# Altium schematic sheet zulu_a7_6.SchDoc
size 241 x 313 mm; Author: Christian Tambe; VERSION#: 1.0; Origin: Eagle; OriginPath: C:\Users\tambe\Documents\Electronics\Zulu_A7\Zulu_Altrium\zulu_a7.sch; OriginSheet: 7; OriginDescription: FPGA POWER
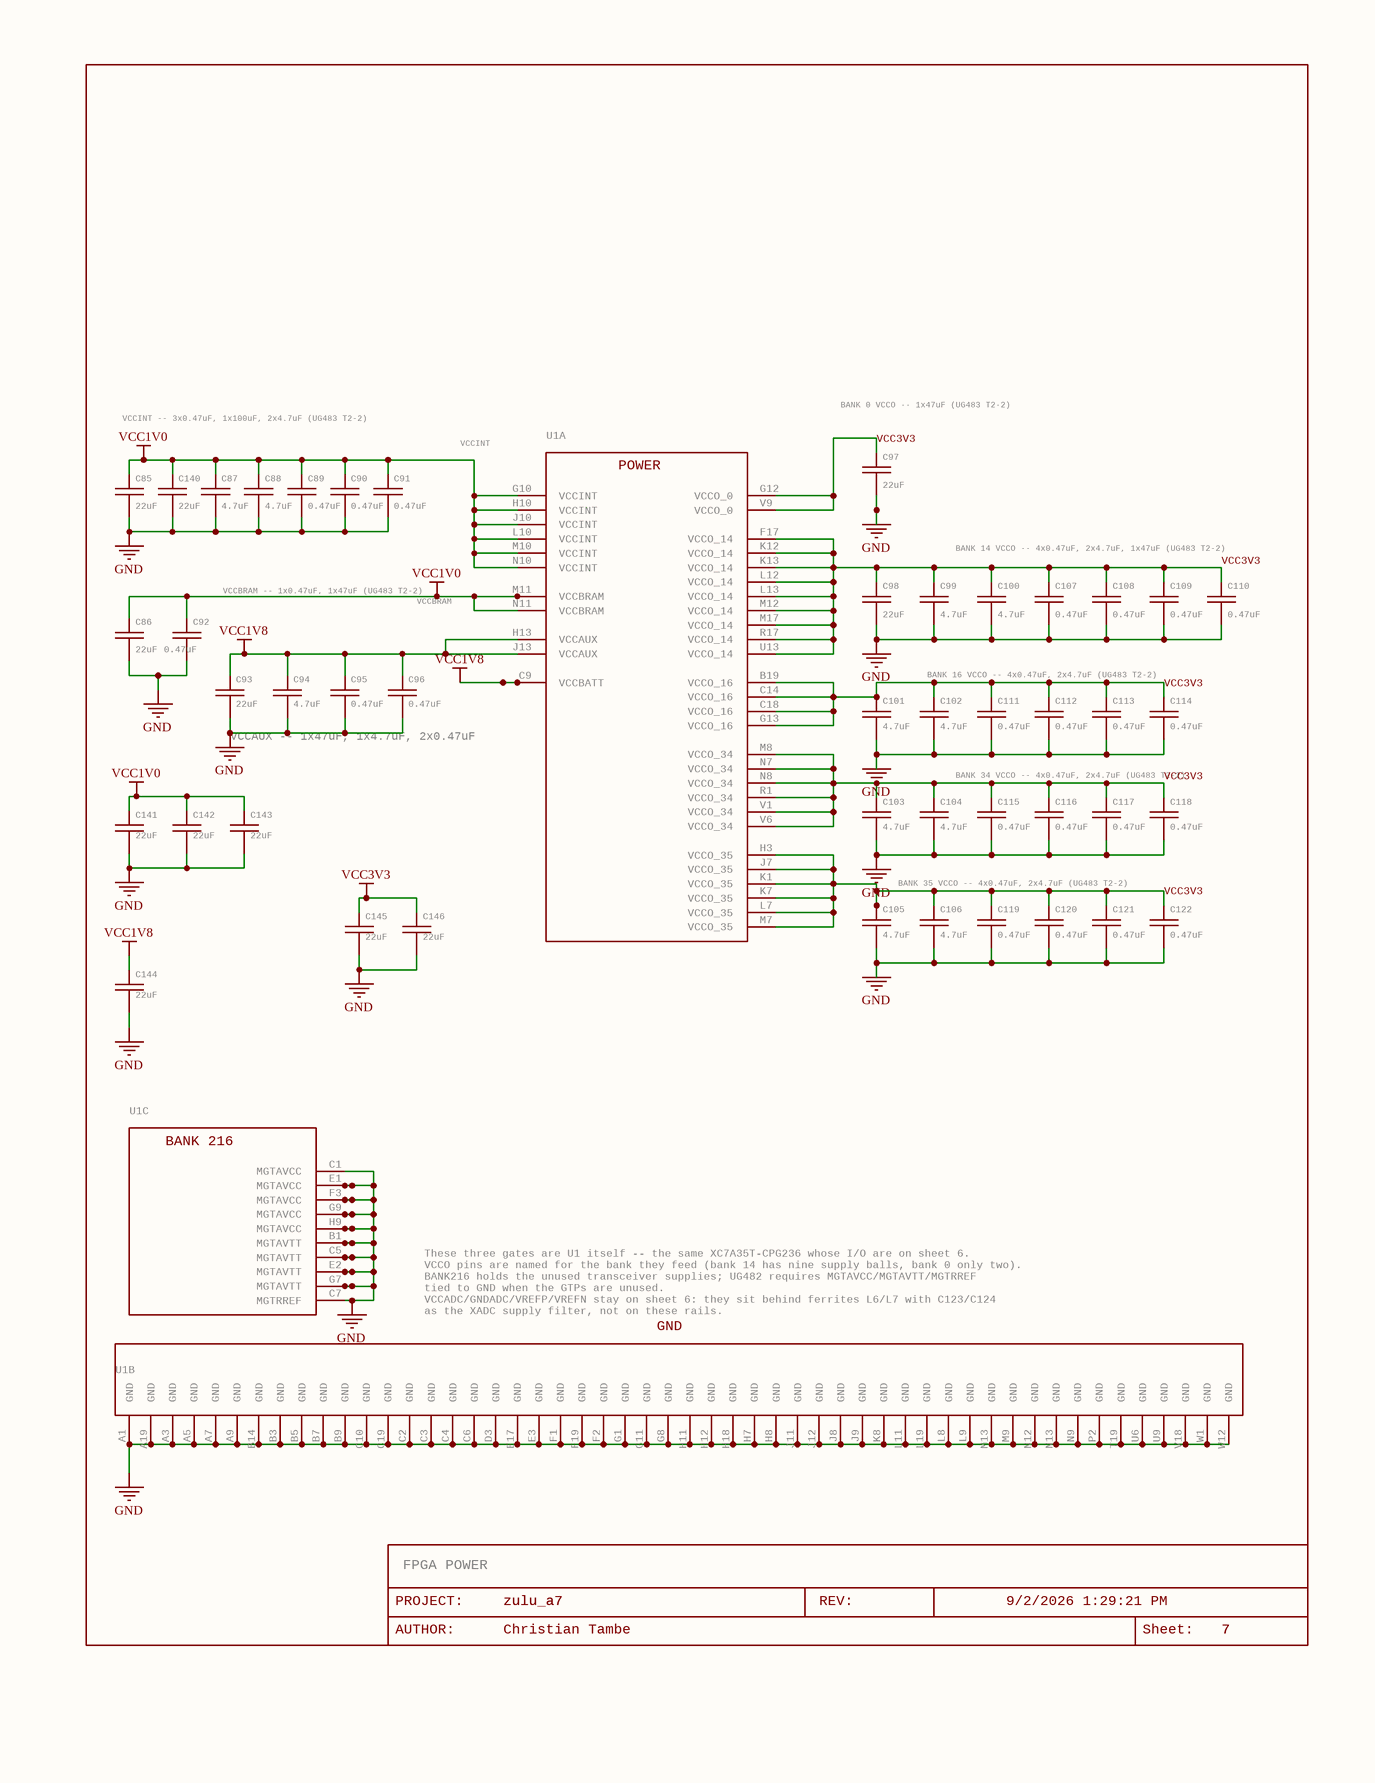
[diagram p0: zulu_a7_6.SchDoc]

## Parts
C85  22uF  [C0805]
C86  22uF  [C0805]
C87  4.7uF  [C0603]
C88  4.7uF  [C0603]
C89  0.47uF  [C0201]
C90  0.47uF  [C0201]
C91  0.47uF  [C0201]
C92  0.47uF  [C0201]
C93  22uF  [C0805]
C94  4.7uF  [C0603]
C95  0.47uF  [C0201]
C96  0.47uF  [C0201]
C97  22uF  [C0805]
C98  22uF  [C0805]
C99  4.7uF  [C0603]
C100  4.7uF  [C0603]
C101  4.7uF  [C0603]
C102  4.7uF  [C0603]
C103  4.7uF  [C0603]
C104  4.7uF  [C0603]
C105  4.7uF  [C0603]
C106  4.7uF  [C0603]
C107  0.47uF  [C0201]
C108  0.47uF  [C0201]
C109  0.47uF  [C0201]
C110  0.47uF  [C0201]
C111  0.47uF  [C0201]
C112  0.47uF  [C0201]
C113  0.47uF  [C0201]
C114  0.47uF  [C0201]
C115  0.47uF  [C0201]
C116  0.47uF  [C0201]
C117  0.47uF  [C0201]
C118  0.47uF  [C0201]
C119  0.47uF  [C0201]
C120  0.47uF  [C0201]
C121  0.47uF  [C0201]
C122  0.47uF  [C0201]
C140  22uF  [C0805]
C141  22uF  [C0805]
C142  22uF  [C0805]
C143  22uF  [C0805]
C144  22uF  [C0805]
C145  22uF  [C0805]
C146  22uF  [C0805]
FRAME6  LAST_DATE_TIME: 9/2/2026 1:29:21 PM  Sheet: Sheet:  SHEET: 7  REV: REV:  PROJECT: PROJECT:  DRAWING_NAME: zulu_a7  AUTHOR: Christian Tambe  (hidden comment: DOCFIELD)  (graphical)
U1  XC7A35T-1CPG236C  [XC7A35T-CPG236]  (value not drawn)  (parts A,B,C of 142)

## Nets
GND: C85.2 C86.2 C87.2 C88.2 C89.2 C90.2 C91.2 C92.2 C93.2 C94.2 C95.2 C96.2 C97.2 C98.2 C99.2 C100.2 C101.2 C102.2 C103.2 C104.2 C105.2 C106.2 C107.2 C108.2 C109.2 C110.2 C111.2 C112.2 C113.2 C114.2 C115.2 C116.2 C117.2 C118.2 C119.2 C120.2 C121.2 C122.2 C140.2 C141.2 C142.2 C143.2 C144.2 C145.2 C146.2 U1.A1(GND) U1.A3(GND) U1.A5(GND) U1.A7(GND) U1.A9(GND) U1.A19(GND) U1.B1(MGTAVTT) U1.B3(GND) U1.B5(GND) U1.B7(GND) U1.B9(GND) U1.B14(GND) U1.C1(MGTAVCC) U1.C2(GND) U1.C3(GND) U1.C4(GND) U1.C5(MGTAVTT) U1.C6(GND) U1.C7(MGTRREF) U1.C10(GND) U1.C19(GND) U1.D3(GND) U1.E1(MGTAVCC) U1.E2(MGTAVTT) U1.E3(GND) U1.E17(GND) U1.F1(GND) U1.F2(GND) U1.F3(MGTAVCC) U1.F19(GND) U1.G1(GND) U1.G7(MGTAVTT) U1.G8(GND) U1.G9(MGTAVCC) U1.G11(GND) U1.H7(GND) U1.H8(GND) U1.H9(MGTAVCC) U1.H11(GND) U1.H12(GND) U1.H18(GND) U1.J8(GND) U1.J9(GND) U1.J11(GND) U1.J12(GND) U1.K8(GND) U1.L8(GND) U1.L9(GND) U1.L11(GND) U1.L19(GND) U1.M9(GND) U1.M13(GND) U1.N9(GND) U1.N12(GND) U1.N13(GND) U1.P2(GND) U1.T19(GND) U1.U6(GND) U1.U9(GND) U1.V18(GND) U1.W1(GND) U1.W12(GND)
VCC1V0: C85.1 C86.1 C87.1 C88.1 C89.1 C90.1 C91.1 C92.1 C140.1 C141.1 C142.1 C143.1 U1.G10(VCCINT) U1.H10(VCCINT) U1.J10(VCCINT) U1.L10(VCCINT) U1.M10(VCCINT) U1.M11(VCCBRAM) U1.N10(VCCINT) U1.N11(VCCBRAM)
VCC1V8: C93.1 C94.1 C95.1 C96.1 C144.1 U1.C9(VCCBATT) U1.H13(VCCAUX) U1.J13(VCCAUX)
VCC3V3: C97.1 C98.1 C99.1 C100.1 C101.1 C102.1 C103.1 C104.1 C105.1 C106.1 C107.1 C108.1 C109.1 C110.1 C111.1 C112.1 C113.1 C114.1 C115.1 C116.1 C117.1 C118.1 C119.1 C120.1 C121.1 C122.1 C145.1 C146.1 U1.B19(VCCO_16) U1.C14(VCCO_16) U1.C18(VCCO_16) U1.F17(VCCO_14) U1.G12(VCCO_0) U1.G13(VCCO_16) U1.H3(VCCO_35) U1.J7(VCCO_35) U1.K1(VCCO_35) U1.K7(VCCO_35) U1.K12(VCCO_14) U1.K13(VCCO_14) U1.L7(VCCO_35) U1.L12(VCCO_14) U1.L13(VCCO_14) U1.M7(VCCO_35) U1.M8(VCCO_34) U1.M12(VCCO_14) U1.M17(VCCO_14) U1.N7(VCCO_34) U1.N8(VCCO_34) U1.R1(VCCO_34) U1.R17(VCCO_14) U1.U13(VCCO_14) U1.V1(VCCO_34) U1.V6(VCCO_34) U1.V9(VCCO_0)

## Notes on the sheet
- VCCINT -- 3x0.47uF, 1x100uF, 2x4.7uF (UG483 T2-2)
- (near C97) BANK 0 VCCO -- 1x47uF (UG483 T2-2)
- VCCINT
- BANK 14 VCCO -- 4x0.47uF, 2x4.7uF, 1x47uF (UG483 T2-2)
- (near C92) VCCBRAM -- 1x0.47uF, 1x47uF (UG483 T2-2)
- VCCBRAM
- BANK 16 VCCO -- 4x0.47uF, 2x4.7uF (UG483 T2-2)
- VCCAUX -- 1x47uF, 1x4.7uF, 2x0.47uF
- BANK 34 VCCO -- 4x0.47uF, 2x4.7uF (UG483 T2-2)
- BANK 35 VCCO -- 4x0.47uF, 2x4.7uF (UG483 T2-2)
- These three gates are U1 itself -- the same XC7A35T-CPG236 whose I/O are on sheet 6.
  VCCO pins are named for the bank they feed (bank 14 has nine supply balls, bank 0 only two).
  BANK216 holds the unused transceiver supplies; UG482 requires MGTAVCC/MGTAVTT/MGTRREF
  tied to GND when the GTPs are unused.
  VCCADC/GNDADC/VREFP/VREFN stay on sheet 6: they sit behind ferrites L6/L7 with C123/C124
  as the XADC supply filter, not on these rails.
- (near FRAME6) FPGA POWER
- (near FRAME6) AUTHOR:

## Library data of the parts
C85 C86 C93 C97 C98 C140 = C-USC0805: CAPACITOR, American symbol; GateName_1: G$1; SymbolName_1: C-US; MANF: Murata; MANF#: GRM21BR61A226ME44L; SPEC: X5R 10V +-20%, 1.45 mm max; DeviceName: C0805; LibraryName: rcl; DeviceSetName: C-US
C87 C88 C94 C99-C106 = C-USC0603: CAPACITOR, American symbol; GateName_1: G$1; SymbolName_1: C-US; MANF: Murata; MANF#: GRM188R61C475KE11D; SPEC: X5R 16V +-10% 0603 4.7uF, 0.95 mm max; 10 V grades (KE15D obsolete, KAAJD NRND) replaced by the 16 V one on 2026-09-08; DeviceName: C0603; LibraryName: rcl; DeviceSetName: C-US
C89-C92 C95 C96 C107-C122 = C-USC0201: CAPACITOR, American symbol; GateName_1: G$1; SymbolName_1: C-US; MANF: Murata; MANF#: GRM033R60J474KE90D; NOTE: 0402 -> 0201 to cut ESL, following Cmod A7. THE VOLTAGE RATING DROPS 16V to 6.3V and that costs real capacitance: on VCC3V3 a 6.3V 0201 sits at 52 percent of rating and DC bias typically removes 60-75 percent of it, against 15-25 percent for the 16V 0402 it replaces. The BOM value is unchanged, so validate.py's UG483 count still passes -- it counts nominal values and cannot see bias derating. Effective decoupling on 3V3 is roughly half what it was. Confirm the MPN suffix and the bias curve against Murata's data before ordering.; SPEC: X5R 6.3V +-10% 0201 0.47uF; KE15D was a typo, KE90D is the live number; DeviceName: C0201; LibraryName: rcl; DeviceSetName: C-US
C141-C146 = C-USC0805: CAPACITOR, American symbol; GateName_1: G$1; SymbolName_1: C-US; MANF: Murata; MANF#: GRM21BR61A226ME44L; NOTE: Second half of a bulk position: each 47uF 1206 became two 22uF 0805. Nominal drops 47 -> 44 uF per position, but the 0805 is 10V where the 1206 was 6.3V, so it derates less under bias and the pair should deliver at least what the single part did. Height also drops 1.60 -> 1.45 mm max, which the back-side budget against the 2.54 mm header standoff cares about.; SPEC: X5R 10V +-20%, 1.45 mm max; DeviceName: C0805; LibraryName: rcl; DeviceSetName: C-US
FRAME6 = DOCFIELD: DOCUMENT FIELD; GateName_1: G$1; SymbolName_1: DOCFIELD; LibraryName: ctambe; DeviceSetName: DOCFIELD
U1 = XC7A35T-CPG236-1CPG236C: Xilinx Artix-7 XC7A35T-1CPG236C   Replacement for the Spartan-6 XC6SLX25-FT256. See design notes: SDRAM/microSD/GPIO ball assignments verified against Digilent Cmod A7-35T (same device+package); config/JTAG/power ball assignments are functionally correct placeholders pending verification against the official Xilinx pinout file.; GateName_1: PWR; SymbolName_1: A7_PWR; GateName_2: GND; SymbolName_2: A7_GND; GateName_3: BANK216; SymbolName_3: A7_BANK216; GateName_4: PART_VALUE; SymbolName_4: PV_GATE; GateName_5: SDRAM_A0; SymbolName_5: PIN_GATE_IO; GateName_6: SDRAM_A1; GateName_7: SDRAM_A2; GateName_8: SDRAM_A3; GateName_9: SDRAM_A4; GateName_10: SDRAM_A5; GateName_11: SDRAM_A6; GateName_12: SDRAM_A7; GateName_13: SDRAM_A8; GateName_14: SDRAM_A9; GateName_15: SDRAM_A10; GateName_16: SDRAM_A11; GateName_17: SDRAM_A12; GateName_18: SDRAM_BA0; GateName_19: SDRAM_BA1; GateName_20: SDRAM_CAS#; GateName_21: SDRAM_RAS#; GateName_22: SDRAM_WE#; GateName_23: SDRAM_CS#; GateName_24: SDRAM_CKE; GateName_25: SDRAM_CLK; GateName_26: SDRAM_LDQM; GateName_27: SDRAM_UDQM; GateName_28: SDRAM_DQ0; GateName_29: SDRAM_DQ1; GateName_30: SDRAM_DQ2; GateName_31: SDRAM_DQ3; GateName_32: SDRAM_DQ4; GateName_33: SDRAM_DQ5; GateName_34: SDRAM_DQ6; GateName_35: SDRAM_DQ7; GateName_36: SDRAM_DQ8; GateName_37: SDRAM_DQ9; GateName_38: SDRAM_DQ10; GateName_39: SDRAM_DQ11; GateName_40: SDRAM_DQ12; GateName_41: SDRAM_DQ13; GateName_42: SDRAM_DQ14; GateName_43: SDRAM_DQ15; GateName_44: SPI_SPI_CCLK; GateName_45: SPI_D00_MOSI; GateName_46: SPI_D01_DIN; GateName_47: SPI_FCS_B; GateName_48: SD_DAT3; GateName_49: SD_DAT2; GateName_50: SD_DAT1; GateName_51: CHAN0; GateName_52: CHAN1; GateName_53: CHAN2; GateName_54: CHAN3; GateName_55: CHAN4; GateName_56: CHAN5; GateName_57: CHAN6; GateName_58: CHAN7; GateName_59: CHAN8; GateName_60: CHAN9; GateName_61: CHAN10; GateName_62: CHAN11; GateName_63: IO_W7; GateName_64: CHAN12; GateName_65: CHAN13; GateName_66: CHAN14; GateName_67: CHAN15; GateName_68: CHAN16; GateName_69: CHAN17; GateName_70: CHAN18; GateName_71: CHAN19; GateName_72: CHAN20; GateName_73: CHAN21; GateName_74: CHAN22; GateName_75: CHAN23; GateName_76: CHAN24; GateName_77: CHAN25; GateName_78: CHAN26; GateName_79: CHAN27; GateName_80: UART_CTS; SymbolName_80: PIN_GATE_OUT; GateName_81: CHAN-CLK; GateName_82: XADC_P; SymbolName_82: PIN_GATE_IN; GateName_83: USB_PWREN; GateName_84: XADC_N; GateName_85: CLK12M; GateName_86: UART_TXD; GateName_87: UART_RXD; GateName_88: PROGRAM_B; GateName_89: INIT_B; GateName_90: DONE; GateName_91: TCK; GateName_92: TMS; GateName_93: TDI; GateName_94: TDO; GateName_95: M0; GateName_96: M1; GateName_97: M2; GateName_98: CFGBVS; GateName_99: PUDC_B; GateName_100: MGTPRXP0; GateName_101: MGTPRXN0; GateName_102: MGTPRXP1; GateName_103: MGTPRXN1; GateName_104: GNDADC; GateName_105: VCCADC; GateName_106: VP; GateName_107: VN; GateName_108: VREFP; GateName_109: VREFN; GateName_110: DXP; GateName_111: DXN; GateName_112: MGTPTXP0; GateName_113: MGTPTXN0; GateName_114: MGTPTXP1; GateName_115: MGTREFCLK0P; GateName_116: MGTREFCLK0N; GateName_117: MGTREFCLK1P; GateName_118: MGTREFCLK1N; GateName_119: MGTPTXN1; GateName_120: CHAN28; GateName_121: LED2; GateName_122: LED0_R; GateName_123: IO_A14; GateName_124: IO_A15; GateName_125: IO_A16; GateName_126: LED1; GateName_127: BTN; GateName_128: SD_DAT0; GateName_129: LED0_G; GateName_130: IO_W19; GateName_131: LED0_B; GateName_132: IO_C15; GateName_133: IO_B15; GateName_134: SD_CLK; GateName_135: UART_RTS; GateName_136: IO_N2; GateName_137: SD_CMD; GateName_138: UART_DTR; GateName_139: SPI_D03; GateName_140: SPI_D02; GateName_141: XADC1_P; GateName_142: XADC1_N; MANF: AMD/Xilinx; SymbolName_6: PIN_GATE_IO; SymbolName_7: PIN_GATE_IO; SymbolName_8: PIN_GATE_IO; SymbolName_9: PIN_GATE_IO; SymbolName_10: PIN_GATE_IO; SymbolName_11: PIN_GATE_IO; SymbolName_12: PIN_GATE_IO; SymbolName_13: PIN_GATE_IO; SymbolName_14: PIN_GATE_IO; SymbolName_15: PIN_GATE_IO; SymbolName_16: PIN_GATE_IO; SymbolName_17: PIN_GATE_IO; SymbolName_18: PIN_GATE_IO; SymbolName_19: PIN_GATE_IO; SymbolName_20: PIN_GATE_IO; SymbolName_21: PIN_GATE_IO; SymbolName_22: PIN_GATE_IO; SymbolName_23: PIN_GATE_IO; SymbolName_24: PIN_GATE_IO; SymbolName_25: PIN_GATE_IO; SymbolName_26: PIN_GATE_IO; SymbolName_27: PIN_GATE_IO; SymbolName_28: PIN_GATE_IO; SymbolName_29: PIN_GATE_IO; SymbolName_30: PIN_GATE_IO; SymbolName_31: PIN_GATE_IO; SymbolName_32: PIN_GATE_IO; SymbolName_33: PIN_GATE_IO; SymbolName_34: PIN_GATE_IO; SymbolName_35: PIN_GATE_IO; SymbolName_36: PIN_GATE_IO; SymbolName_37: PIN_GATE_IO; SymbolName_38: PIN_GATE_IO; SymbolName_39: PIN_GATE_IO; SymbolName_40: PIN_GATE_IO; SymbolName_41: PIN_GATE_IO; SymbolName_42: PIN_GATE_IO; SymbolName_43: PIN_GATE_IO; SymbolName_44: PIN_GATE_IO; SymbolName_45: PIN_GATE_IO; SymbolName_46: PIN_GATE_IO; SymbolName_47: PIN_GATE_IO; SymbolName_48: PIN_GATE_IO; SymbolName_49: PIN_GATE_IO; SymbolName_50: PIN_GATE_IO; SymbolName_51: PIN_GATE_IO; SymbolName_52: PIN_GATE_IO; SymbolName_53: PIN_GATE_IO; SymbolName_54: PIN_GATE_IO; SymbolName_55: PIN_GATE_IO; SymbolName_56: PIN_GATE_IO; SymbolName_57: PIN_GATE_IO; SymbolName_58: PIN_GATE_IO; SymbolName_59: PIN_GATE_IO; SymbolName_60: PIN_GATE_IO; SymbolName_61: PIN_GATE_IO; SymbolName_62: PIN_GATE_IO; SymbolName_63: PIN_GATE_IO; SymbolName_64: PIN_GATE_IO; SymbolName_65: PIN_GATE_IO; SymbolName_66: PIN_GATE_IO; SymbolName_67: PIN_GATE_IO; SymbolName_68: PIN_GATE_IO; SymbolName_69: PIN_GATE_IO; SymbolName_70: PIN_GATE_IO; SymbolName_71: PIN_GATE_IO; SymbolName_72: PIN_GATE_IO; SymbolName_73: PIN_GATE_IO; SymbolName_74: PIN_GATE_IO; SymbolName_75: PIN_GATE_IO; SymbolName_76: PIN_GATE_IO; SymbolName_77: PIN_GATE_IO; SymbolName_78: PIN_GATE_IO; SymbolName_79: PIN_GATE_IO; SymbolName_81: PIN_GATE_IO; SymbolName_83: PIN_GATE_IN; SymbolName_84: PIN_GATE_IN; SymbolName_85: PIN_GATE_IN; SymbolName_86: PIN_GATE_IO; SymbolName_87: PIN_GATE_IO; SymbolName_88: PIN_GATE_IN; SymbolName_89: PIN_GATE_IN; SymbolName_90: PIN_GATE_IN; SymbolName_91: PIN_GATE_IN; SymbolName_92: PIN_GATE_IN; SymbolName_93: PIN_GATE_IN; SymbolName_94: PIN_GATE_IN; SymbolName_95: PIN_GATE_IN; SymbolName_96: PIN_GATE_IN; SymbolName_97: PIN_GATE_IN; SymbolName_98: PIN_GATE_IN; SymbolName_99: PIN_GATE_IN; SymbolName_100: PIN_GATE_IN; SymbolName_101: PIN_GATE_IN; SymbolName_102: PIN_GATE_IN; SymbolName_103: PIN_GATE_IN; SymbolName_104: PIN_GATE_IN; SymbolName_105: PIN_GATE_IN; SymbolName_106: PIN_GATE_IN; SymbolName_107: PIN_GATE_IN; SymbolName_108: PIN_GATE_IN; SymbolName_109: PIN_GATE_IN; SymbolName_110: PIN_GATE_IN; SymbolName_111: PIN_GATE_IN; SymbolName_112: PIN_GATE_IN; SymbolName_113: PIN_GATE_IN; SymbolName_114: PIN_GATE_IN; SymbolName_115: PIN_GATE_IN; SymbolName_116: PIN_GATE_IN; SymbolName_117: PIN_GATE_IN; SymbolName_118: PIN_GATE_IN; SymbolName_119: PIN_GATE_IN; SymbolName_120: PIN_GATE_IN; SymbolName_121: PIN_GATE_IN; SymbolName_122: PIN_GATE_IN; SymbolName_123: PIN_GATE_IN; SymbolName_124: PIN_GATE_IN; SymbolName_125: PIN_GATE_IN; SymbolName_126: PIN_GATE_IN; SymbolName_127: PIN_GATE_IN; SymbolName_128: PIN_GATE_IO; SymbolName_129: PIN_GATE_IN; SymbolName_130: PIN_GATE_IN; SymbolName_131: PIN_GATE_IN; SymbolName_132: PIN_GATE_IN; SymbolName_133: PIN_GATE_IN; SymbolName_134: PIN_GATE_IO; SymbolName_135: PIN_GATE_IN; SymbolName_136: PIN_GATE_IN; SymbolName_137: PIN_GATE_IO; SymbolName_138: PIN_GATE_IN; SymbolName_139: PIN_GATE_IO; SymbolName_140: PIN_GATE_IO; SymbolName_141: PIN_GATE_IN; SymbolName_142: PIN_GATE_IN; DeviceName: -1CPG236C; LibraryName: ctambe; DeviceSetName: XC7A35T-CPG236; POWER: POWER; MANF#: XC7A35T-1CPG236C